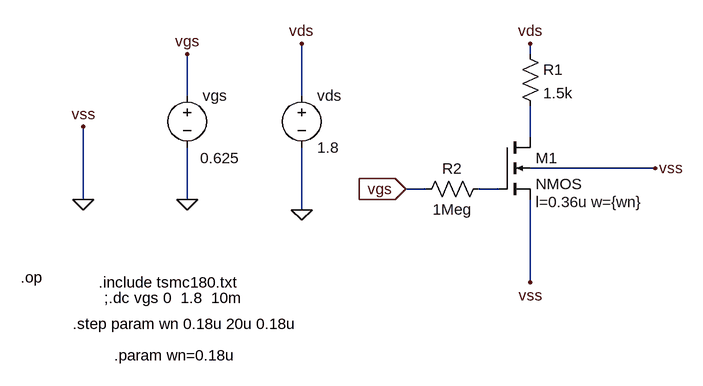
[diagram p0: schematic NMOS_CHART_SETUP.asc]
NMOS_CHART_SETUP.asc, the LTspice schematic file:
Version 4
SHEET 1 880 680
WIRE 208 -32 208 -48
WIRE -320 32 -320 -32
WIRE -144 32 -144 -48
WIRE 208 96 208 48
WIRE 400 144 208 144
WIRE 48 176 16 176
WIRE 160 176 128 176
WIRE -480 192 -480 80
WIRE -320 192 -320 112
WIRE -144 208 -144 112
WIRE 208 320 208 192
FLAG -320 192 0
FLAG -480 192 0
FLAG -144 208 0
FLAG -480 80 vss
FLAG 400 144 vss
FLAG 208 320 vss
FLAG -320 -32 vgs
FLAG -144 -48 vds
FLAG 16 176 vgs
IOPIN 16 176 In
FLAG 208 -48 vds
SYMBOL nmos4 160 96 R0
WINDOW 123 56 100 Left 2
SYMATTR Value2 l=0.36u w={wn}
SYMATTR InstName M1
SYMBOL voltage -320 16 R0
WINDOW 3 20 112 Left 2
WINDOW 123 0 0 Left 0
WINDOW 39 0 0 Left 0
SYMATTR Value 0.625
SYMATTR InstName vgs
SYMBOL voltage -144 16 R0
WINDOW 123 0 0 Left 0
WINDOW 39 0 0 Left 0
SYMATTR InstName vds
SYMATTR Value 1.8
SYMBOL res 192 -48 R0
SYMATTR InstName R1
SYMATTR Value 1.5k
SYMBOL res 144 160 R90
WINDOW 0 0 56 VBottom 2
WINDOW 3 32 56 VTop 2
SYMATTR InstName R2
SYMATTR Value 1Meg
TEXT -456 320 Left 2 !.include tsmc180.txt
TEXT -448 344 Left 2 !;.dc vgs 0  1.8  10m
TEXT -496 384 Left 2 !.step param wn 0.18u 20u 0.18u
TEXT -432 432 Left 2 !.param wn=0.18u
TEXT -576 312 Left 2 !.op

The netlist it stands for:
* NMOS_CHART_SETUP.asc
M1 N001 N002 0 0 NMOS l=0.36u w={wn}
vgs vgs 0 0.625
vds vds 0 1.8
R1 vds N001 1.5k
R2 N002 vgs 1Meg
.model NMOS NMOS
.model PMOS PMOS
.lib standard.mos
.include tsmc180.txt
;.dc vgs 0  1.8  10m
.step param wn 0.18u 20u 0.18u
.param wn=0.18u
.op
.backanno
.end